# EAGLE design relay_wired (EAGLE 7.7.0)
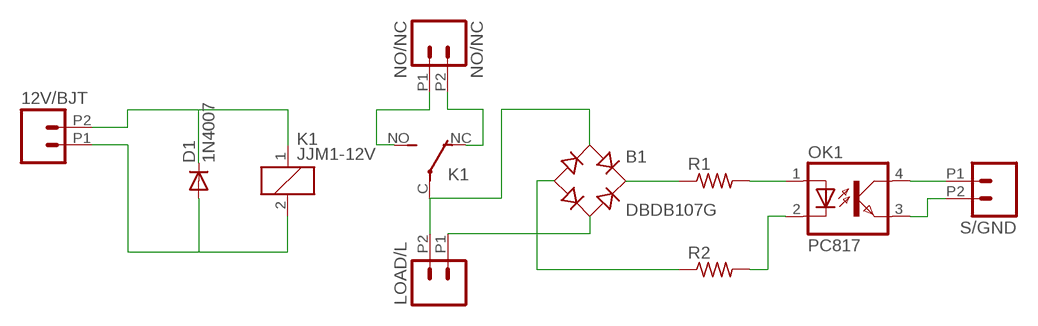
[diagram p0: schematic, sheet 1]

## Parts
12V/BJT  M022.54MM_SCREWTERM  [1X02_2.54_SCREWTERM]
B1  DBDB107G  [DB]
D1  1N4007  1N4004  [DO41-10]
K1  JJM1-12V  [JJM1C]
LOAD/L  M022.54MM_SCREWTERM  [1X02_2.54_SCREWTERM]
NO/NC  NO/NC  M022.54MM_SCREWTERM  [1X02_2.54_SCREWTERM]
OK1  PC817  [DIL04]
R1  R-US_0207/10  [0207/10]
R2  R-US_0207/10  [0207/10]
S/GND  M022.54MM_SCREWTERM  [1X02_2.54_SCREWTERM]

## Nets
N$1: 12V/BJT.P2 D1.C K1.1
N$2: 12V/BJT.P1 D1.A K1.2
N$3: B1.AC1 K1.C(2:P) LOAD/L.P2
N$4: K1.NC(2:O) NO/NC.P2
N$5: K1.NO(2:S) NO/NC.P1
N$6: OK1.1(A) R1.2
N$7: B1.AC2 LOAD/L.P1
N$8: B1.- R2.1
N$9: B1.+ R1.1
N$10: OK1.2(C) R2.2
N$11: OK1.4(COL) S/GND.P1
N$12: OK1.3(EMIT) S/GND.P2

## Library data of the parts
12V/BJT LOAD/L NO/NC S/GND = SparkFun-Connectors:M02: Standard 2-pin 0.1" header. Use with - straight break away headers ( PRT-00116) - right angle break away headers (PRT-00553) - swiss pins (PRT-00743) - machine pins (PRT-00117) - female headers (PRT-00115) Molex polarized connector foot print use with: PRT-08233 with associated crimp pins and housings. 2.54_SCREWTERM for use with PRT-10571. 3.5mm Screw Terminal footprints for PRT-08084 5mm Screw Terminal footprints for use with PRT-08432
B1 = rectifier:DB?*G: Single Phase 1.0 AMP Glass Passivated Bridge Rectifier Taiwan Semiconductor Co.,Ltd. - TSC Source: http://www.taiwansemi.com/TSCbig5/ezcatfiles/cust/img/img/db101g.pdf http://www.ts.com.tw/db/pictures/modules/PDT/PDT060207001/DBLS201G.pdf
D1 = adafruit:1N4004: DIODE General purpose 1N400x type rectifier (With bigger pads) http://www.ladyada.net/library/pcb/eaglelibrary.html
K1 = relay:JJM1-12V: HALF-SIZE AUTOMOTIVE RELAY NAiS Source: http://www.mew-europe.com/.. en_ds_61210_0001.pdf; MF: AROMAT/ MATSUSHITA; MPN: JJM1-12V; OC_FARNELL: unknown; OC_NEWARK: 10C7318
OK1 = optocoupler:PC817: SHARP OPTO COUPLER; MPN: PC817X4J000F; OC_FARNELL: 9707727; OC_NEWARK: 97K7059
R1 R2 = resistor:R-US_: RESISTOR, American symbol

## Board
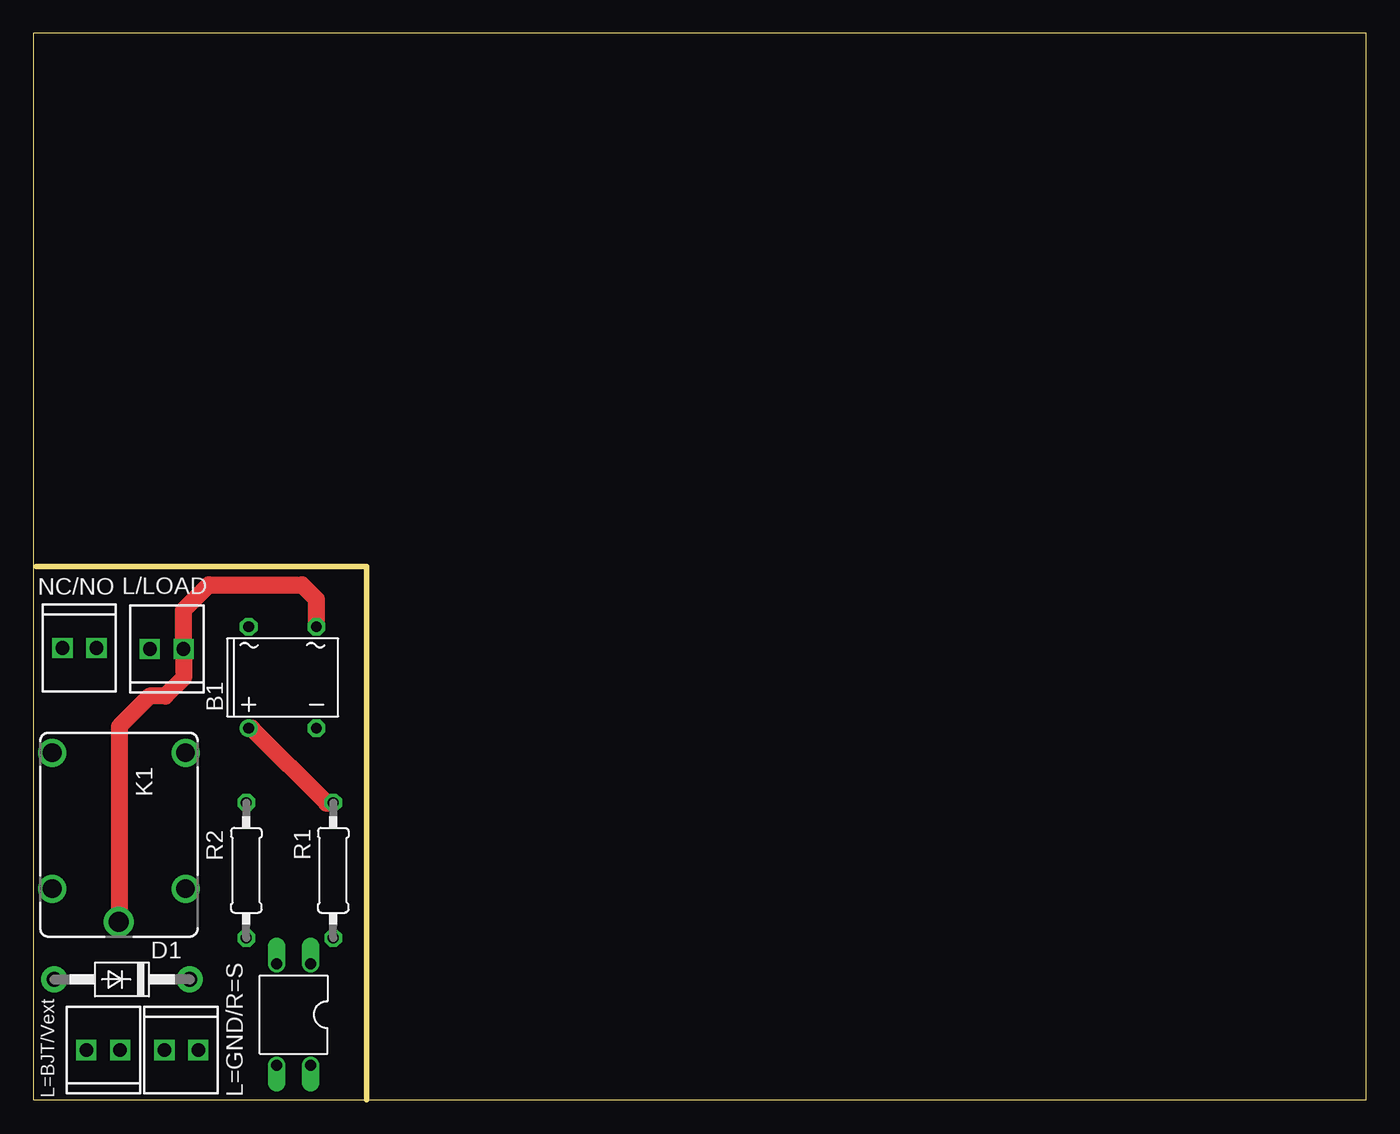
[diagram p1: board, top side]
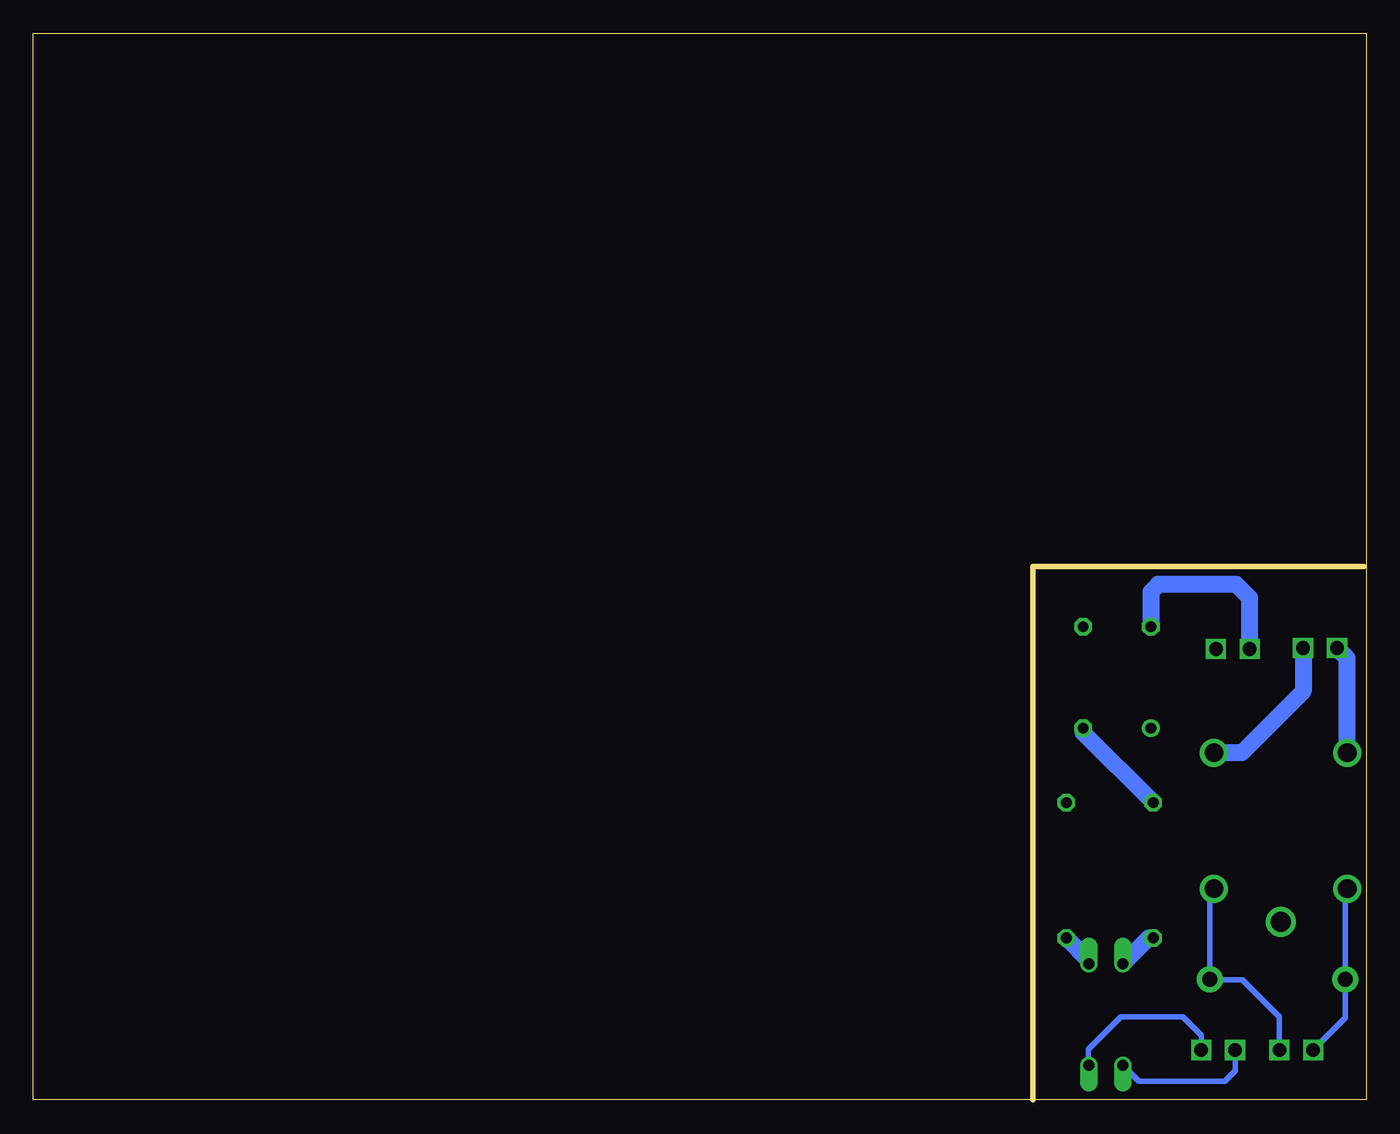
[diagram p2: board, bottom side, seen from below]

Size 100 x 80 mm. Coordinates in mm from the lower left corner, seen from the top.
Outline: 25,0 0,0 0,80 100,80 100,0 25,0
Outline: 0.2,40 25,40 25,0
Copper layers (1*16): Top 0.035mm / dielectric 1.5mm / Bottom 0.035mm
Design rules "default": minimum track width 10mil, minimum drill 24mil, track to track 8mil, track to pad 8mil, pad to pad 8mil, via to via 8mil, smd to smd 8mil, copper to edge 40mil, drill to drill 8mil, minimum pad ring 10mil, minimum via ring 8mil, stop-mask expansion 4mil, vias tented up to drill 0mil, thermal gap 10mil

### Footprints (pad centres in the part's own frame; a part is rotated, then mirrored left to right if it is on the bottom)
1X02_2.54_SCREWTERM = drill 1.016 square: P1 2.54,0; P2 0,0
DB = drill 0.813: + -2.54,-3.81 | drill 0.813 octagon: - 2.54,-3.81; AC1 2.54,3.81; AC2 -2.54,3.81
DO41-10 = drill 1.118 pad 1.93: A 5.08,0; C -5.08,0
JJM1C = drill 1.4: 1 4.05,5; 2 4.05,-5; NC -6.15,-5; NO -6.15,5 | drill 1.5: C 6.55,0
DIL04 = drill 0.813 offset: 1 -1.27,-3.81; 2 1.27,-3.81; 3 1.27,3.81; 4 -1.27,3.81
0207/10 = drill 0.813 octagon: 1 -5.08,0; 2 5.08,0

### Placement (x,y rotation side)
12V/BJT  6.52,3.71 180 top
B1  18.7,31.67 0 top
D1  6.66,9.01 180 top
K1  6.42,19.87 270 top
LOAD/L  11.28,33.8 180 top
NO/NC  2.19,33.88 0 top
OK1  19.53,6.37 180 top
R1  22.5,17.2 270 top
R2  15.98,17.2 270 top
S/GND  9.83,3.72 0 top

### Tracks (layer width: path | path; a pad name or v marks a point on that pad's centre or on a via)
N$1
  Bottom 0.406: K1.1 11.74,15.51 D1.C 11.71,8.99 9.3,8.99 6.51,6.21 12V/BJT.P2
N$2
  Bottom 0.406: K1.2 1.58,15.67 D1.A 1.58,6.11 12V/BJT.P1
N$3
  Top 1.27: B1.AC1 21.23,37.54 20.17,38.61 13.16,38.61 11.28,36.73 LOAD/L.P2 11.28,31.65 9.91,30.28 8.74,30.28 6.45,27.99 6.45,13.34 K1.C
N$4
  Bottom 1.27: K1.NC 1.43,33.12 NO/NC.P2
N$5
  Bottom 1.27: NO/NC.P1 4.73,30.63 9.35,26.01 K1.NO
N$6
  Bottom 0.406: OK1.1 20.8,10.42
  Bottom 1.27: 20.8,10.42 R1.2
N$7
  Bottom 1.27: B1.AC2 16.15,38.1 15.6,38.66 9.75,38.66 8.74,37.64 LOAD/L.P1
N$8
  Bottom 1.27: B1.- 21.24,27.54 R2.1
N$9
  Top 1.27: B1.+ 16.39,27.86 22,22.25 22.47,22.25 R1.1
N$10
  Bottom 0.406: R2.2 16.32,12.12
  Bottom 1.27: 16.32,12.12 OK1.2
N$11
  Bottom 0.406: S/GND.P1 12.37,4.8 13.77,6.2 18.39,6.2 20.83,3.76 20.83,2.59 OK1.4
N$12
  Bottom 0.406: S/GND.P2 9.83,2.16 10.62,1.37 17.07,1.37 OK1.3

### Text on the board
tNames: NC/NO | L/LOAD | L=GND/R=S | L=BJT/Vext